# Altium schematic sheet MainBoard_KONZEVIC.SchDoc
size 420 x 297 mm; DocumentNumber: VSL.23-MOTHERBOARD; SheetNumber: 8; Format: A3
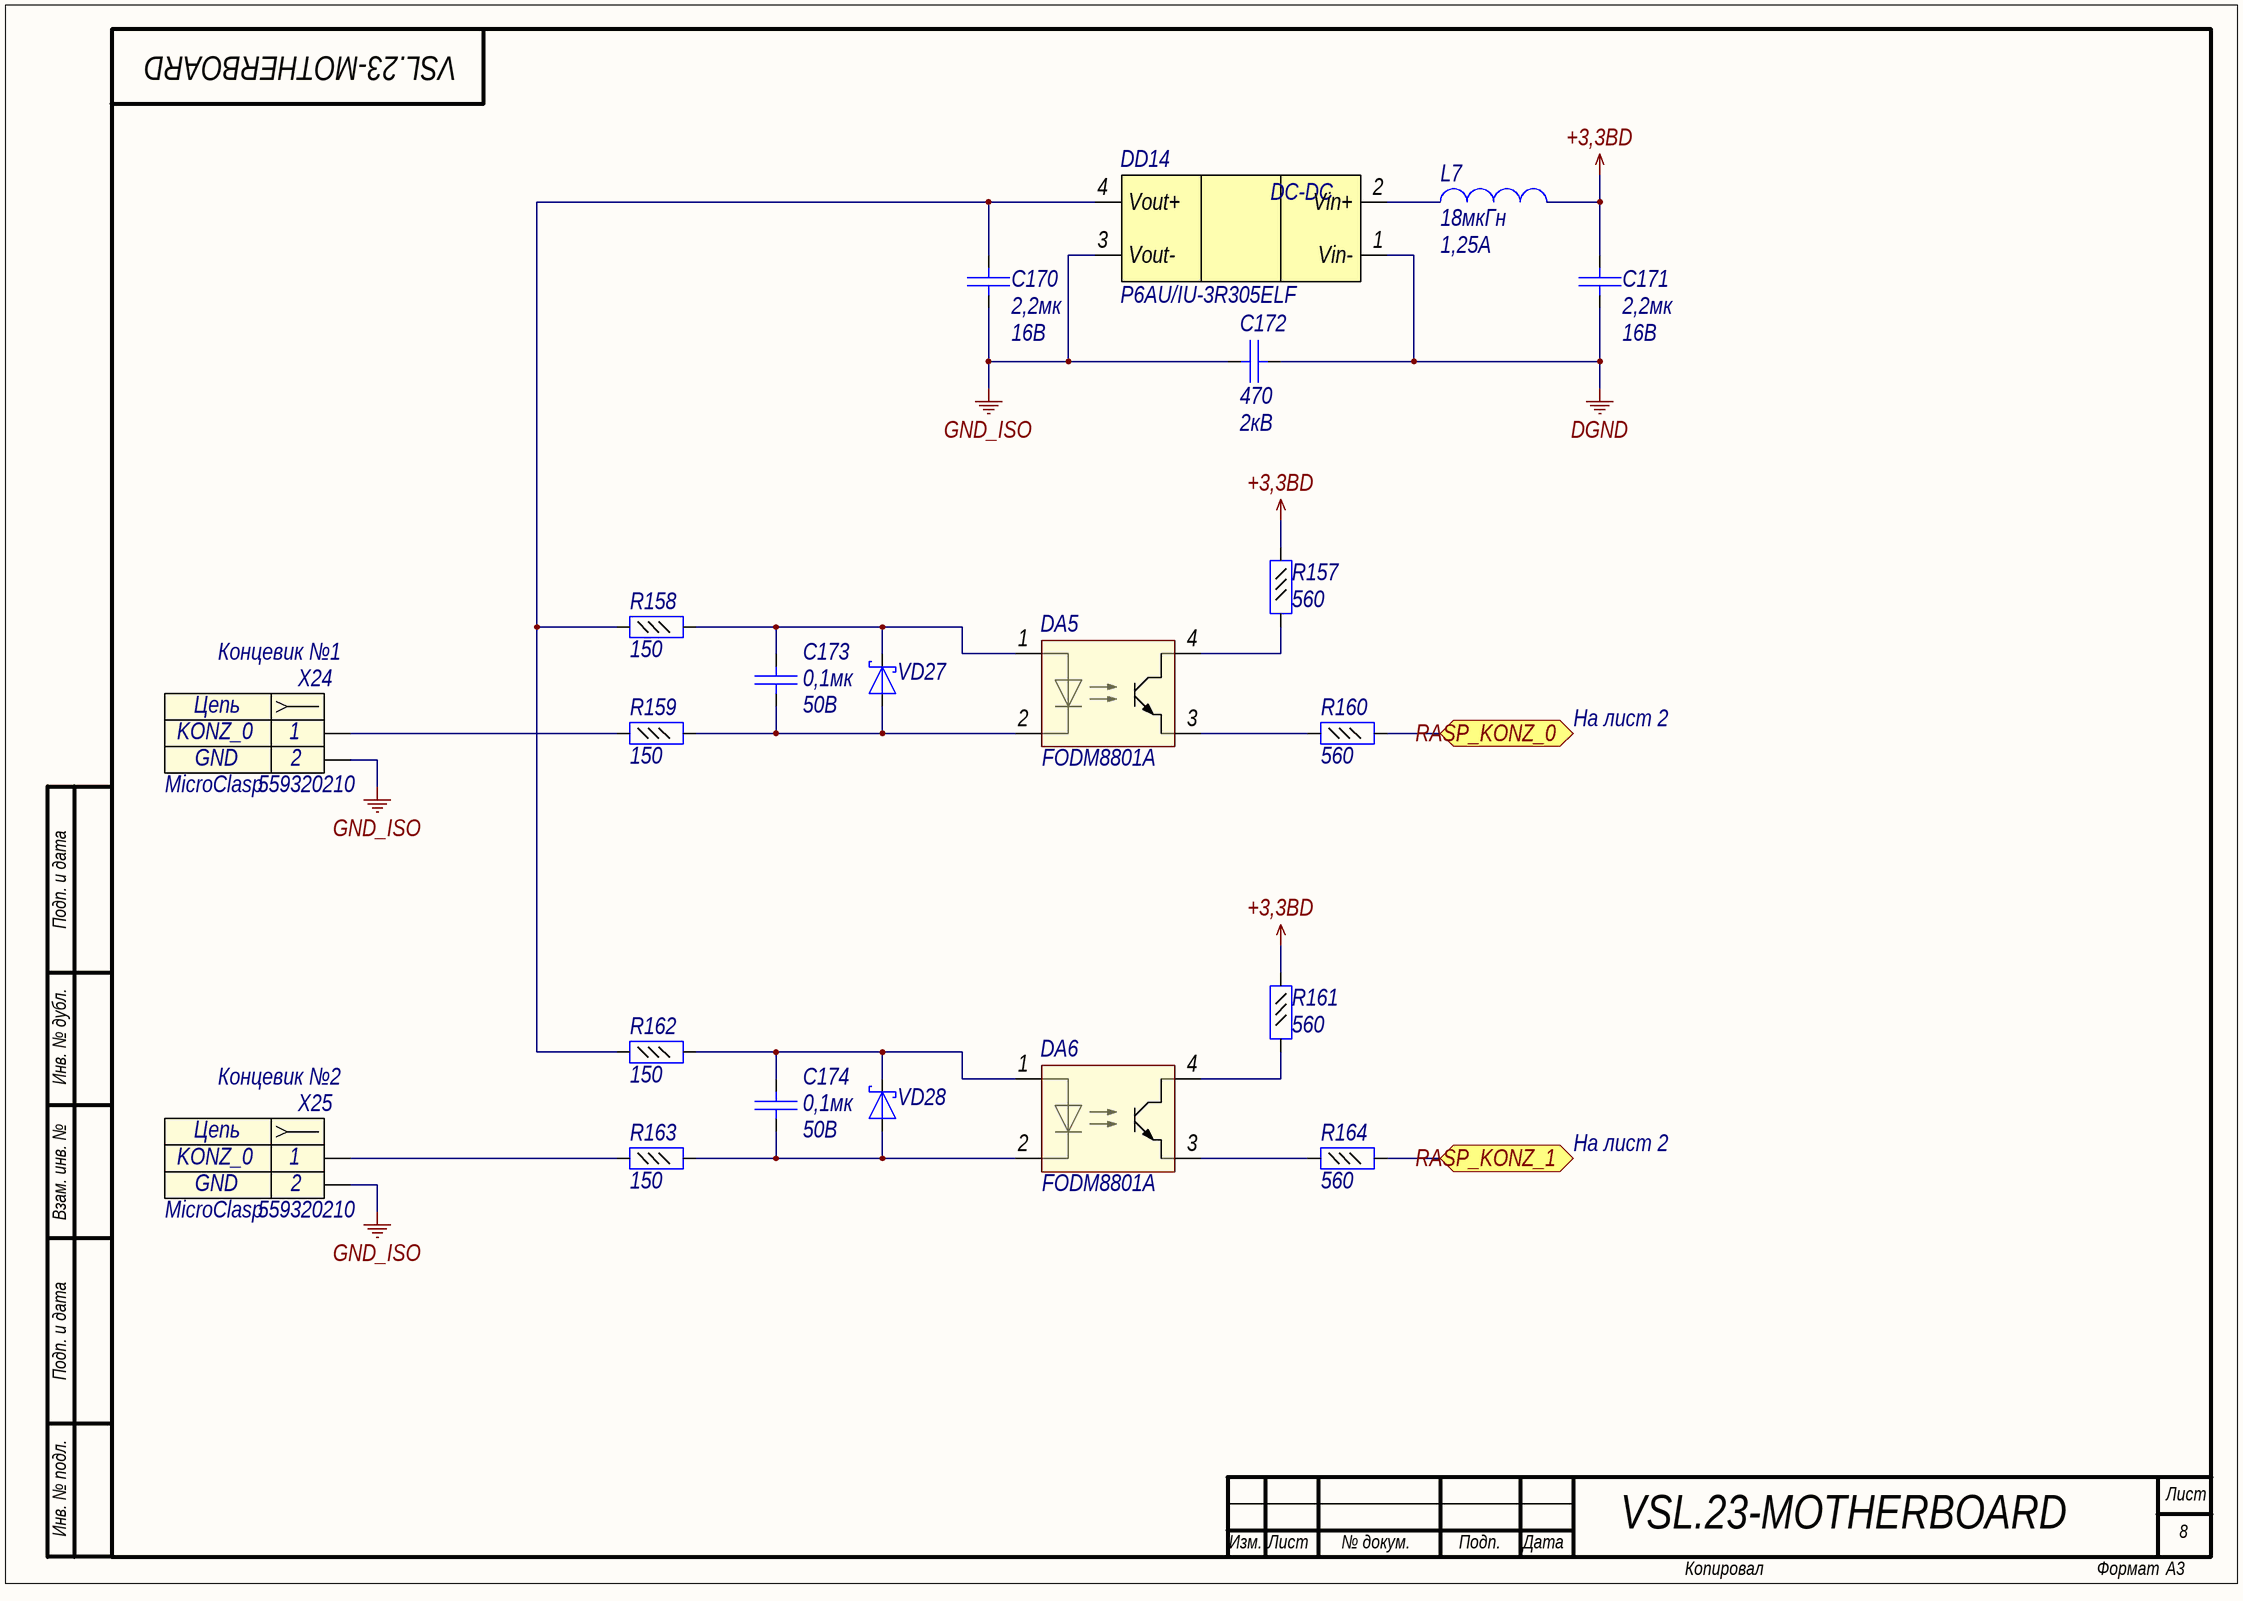
[diagram p0: MainBoard_KONZEVIC.SchDoc]

## Parts
C170  Voltage: 16B  [C0603]  (hidden comment: 2,2мк)
C171  Voltage: 16B  [C0603]  (hidden comment: 2,2мк)
C172  value 470  Voltage: 2кВ  [C1206]  (hidden comment: Capacitor)
C173  value 0,1мк  Voltage: 50В  [C0402]  (hidden comment: Capacitor)
C174  value 0,1мк  Voltage: 50В  [C0402]  (hidden comment: Capacitor)
DA5  Part Number: FODM8801A  [Miniflat4]  (hidden comment: OPTO-1)
DA6  Part Number: FODM8801A  [Miniflat4]  (hidden comment: OPTO-1)
DD14  Part Number: P6AU/IU-3R305ELF  [SIP4]  (hidden comment: P6AU-xxxxELF)
L7  value 18мкГн  Rated Current: 1,25A  [SDR0604]  (hidden comment: Inductor)
R157  value 560  [R0402]  (hidden comment: Resistor_0,062Вт)
R158  value 150  [R0402]  (hidden comment: Resistor_0,062Вт)
R159  value 150  [R0402]  (hidden comment: Resistor_0,062Вт)
R160  value 560  [R0402]  (hidden comment: Resistor_0,062Вт)
R161  value 560  [R0402]  (hidden comment: Resistor_0,062Вт)
R162  value 150  [R0402]  (hidden comment: Resistor_0,062Вт)
R163  value 150  [R0402]  (hidden comment: Resistor_0,062Вт)
R164  value 560  [R0402]  (hidden comment: Resistor_0,062Вт)
VD27  DiodeSchottky  [SOD-123]  (value not drawn)
VD28  DiodeSchottky  [SOD-123]  (value not drawn)
X24  Концевик №1  Part Name: MicroClasp  Part Number: 559320210  [MOLEX_559320210]
X25  Концевик №2  Part Name: MicroClasp  Part Number: 559320210  [MOLEX_559320210]

## Ports
RASP_KONZ_0, RASP_KONZ_1

## Nets
+3,3BD: C171.2 L7.1 R157.1 R161.1
DGND: C171.1 C172.1 DD14.1(Vin-)
GND_ISO: C170.1 C172.2 DD14.3(Vout-) X24.2 X25.2
RASP_KONZ_0: R160.2 ; port RASP_KONZ_0
RASP_KONZ_1: R164.2 ; port RASP_KONZ_1
NetC170_2: C170.2 DD14.4(Vout+) R158.1 R162.1
NetC173_1: C173.1 DA5.2 R159.2 VD27.2(A)
NetC173_2: C173.2 DA5.1 R158.2 VD27.1(K)
NetC174_1: C174.1 DA6.2 R163.2 VD28.2(A)
NetC174_2: C174.2 DA6.1 R162.2 VD28.1(K)
NetDA5_3: DA5.3 R160.1
NetDA5_4: DA5.4 R157.2
NetDA6_3: DA6.3 R164.1
NetDA6_4: DA6.4 R161.2
NetDD14_2: DD14.2(Vin+) L7.2
NetR159_1: R159.1 X24.1
NetR163_1: R163.1 X25.1

## Notes on the sheet
- На лист 2
- Подп. и дата
- Инв. № дубл.
- Взам. инв. №
- Инв. № подл.
- Лист
- Изм.
- № докум.
- Подп.
- Дата
- Копировал
- Формат
- (in symbol connect95) Цепь
- (in symbol pwr54) DC-DC

## Library data of the parts
C170 C171 = cap287: Конденсатор; Part Name: Ceramic; Manufacture: Murata; Part Number: GRM188Z71C225ME43J; id: cap287; TKE: X7R; tga: 0,10%; Value: 2,2мк
C172 = cap284: Конденсатор; Part Name: Ceramic; Manufacture: Yageo; Part Number: CC1206KKX7RDBB471; id: cap284; TKE: X7R
C173 C174 = cap277: Конденсатор; Part Name: Ceramic; Manufacture: Murata; Part Number: GRM155R71H104KE14D; id: cap277; TKE: X7R; tga: 0,10%
DA5 DA6 = FODM8801A: Опторазвязка; Manufacturer: ON Semiconductor; id: opto2; Forward current: 20мА; Forward Voltage: 1,8B; Reverse voltage: 6B; Continuous collector current: 30mA; Voltage coll-emmiter: 75B; Max tempreture: +125; Min tempreture: -40; Power dissipation: 300mW
DD14 = pwr54: DC/DC преобразователь; Part Name: DC/DC Converter Isolated; Manufacturer: PEAK Electronics; id: pwr54; Input Voltage: 3,3B; Output Voltage: 5B; Current: 200mA; Type: Isolated
L7 = ind45: EMI Suppression Filter; Part Name: SMD Power Inductors; Part Number: SDR0604- 180YL; Manufacture: Bourns; id: ind45; Saturation Current: 1,5A; Resistance: 0,15Ohm
R157 R160 R161 R164 = res264: Резистор; Manufacture: Yageo; Part Number: RC0402FR-07560RL; id: res264; Accuracy: 0,01; Part Name: Resistor; Power: 0,062Вт
R158 R159 R162 R163 = res250: Резистор; Manufacture: Yageo; Part Number: RC0402FR-07150RL; id: res250; Accuracy: 0,01; Part Name: Resistor; Power: 0,062Вт
VD27 VD28 = diode27: Диод Шоттки; Part Number: MBR2H100SFT3G; Manufacture: ON Semiconductor; Max Reverse Voltage: 100B; Forward Current: 2А; Breakdown Current: 0,5mA; Number of Channels: 1; id: diode27; Part Name: Diode Schottky; Breakdown Voltage: 100B
X24 X25 = connect95: Разъем - 2 конт. розетка; Manufacture: Molex; Contact_1: KONZ_0; Contact_2: GND; Etch: 2mm; id: connect95